# EAGLE design v8_4_controler (EAGLE 9.6.2)
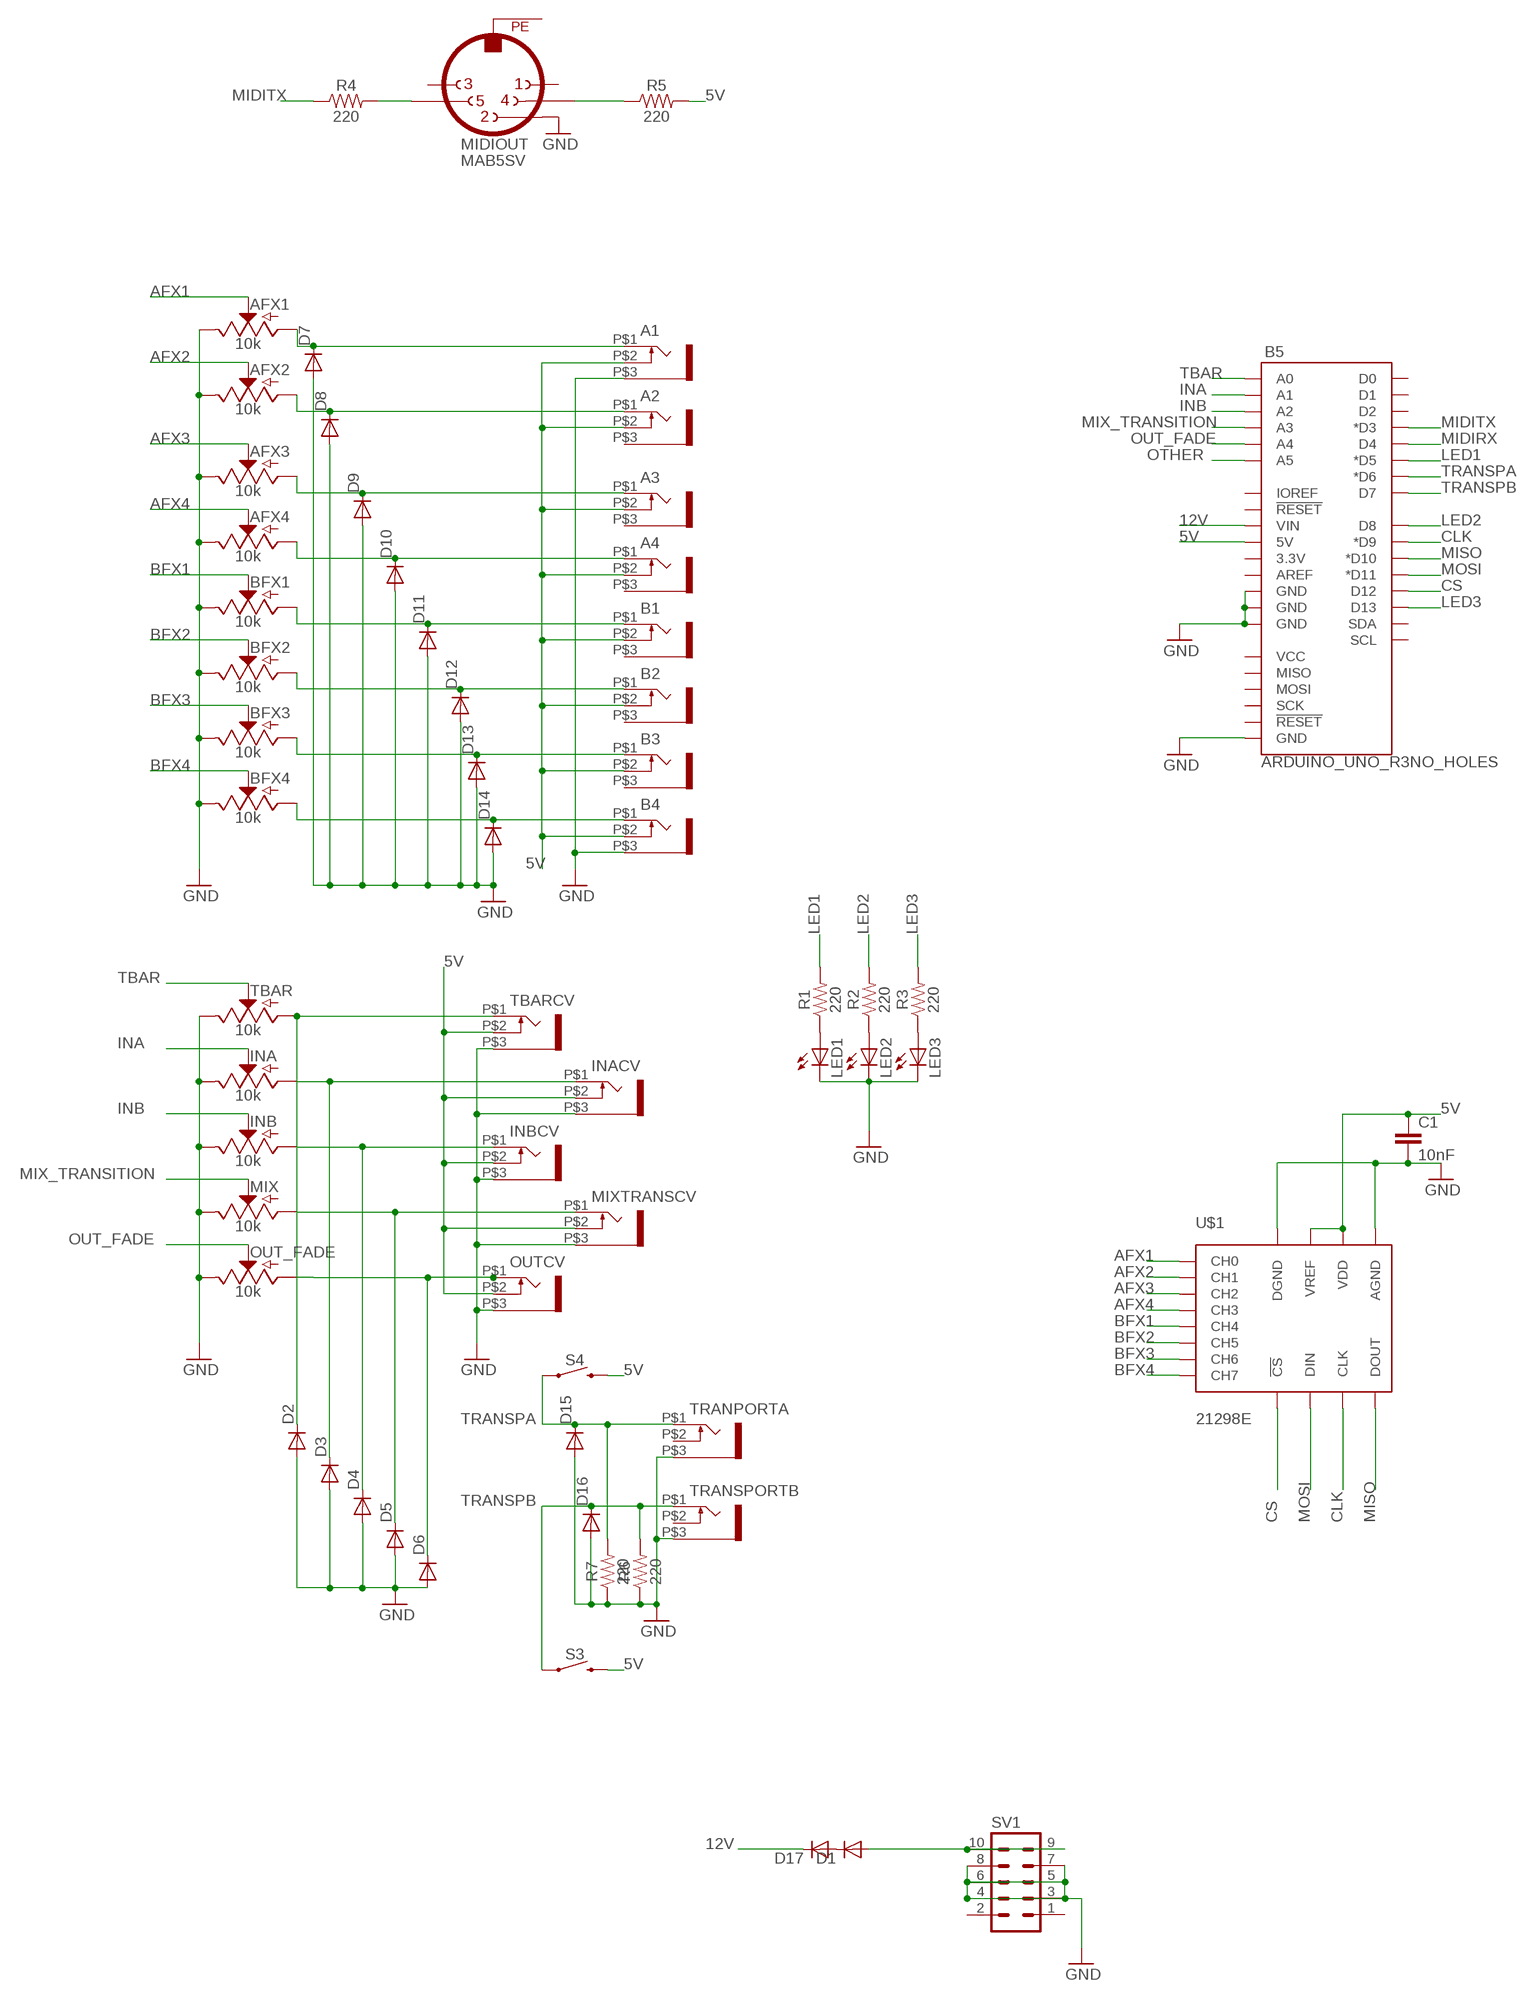
[diagram p0: schematic, sheet 1]

## Parts
A1  WQP-PJ301M-12_JACK  [WQP-PJ301M-12_JACK]
A2  WQP-PJ301M-12_JACK  [WQP-PJ301M-12_JACK]
A3  WQP-PJ301M-12_JACK  [WQP-PJ301M-12_JACK]
A4  WQP-PJ301M-12_JACK  [WQP-PJ301M-12_JACK]
AFX1  10k  POTENTIOMETER-PTH-9MM-1/20W-20%  [POT-PTH-ALPS]
AFX2  10k  POTENTIOMETER-PTH-9MM-1/20W-20%  [POT-PTH-ALPS]
AFX3  10k  POTENTIOMETER-PTH-9MM-1/20W-20%  [POT-PTH-ALPS]
AFX4  10k  POTENTIOMETER-PTH-9MM-1/20W-20%  [POT-PTH-ALPS]
B1  WQP-PJ301M-12_JACK  [WQP-PJ301M-12_JACK]
B2  WQP-PJ301M-12_JACK  [WQP-PJ301M-12_JACK]
B3  WQP-PJ301M-12_JACK  [WQP-PJ301M-12_JACK]
B4  WQP-PJ301M-12_JACK  [WQP-PJ301M-12_JACK]
B5  ARDUINO_UNO_R3NO_HOLES  [ARDUINO_R3_NO_HOLES]
BFX1  10k  POTENTIOMETER-PTH-9MM-1/20W-20%  [POT-PTH-ALPS]
BFX2  10k  POTENTIOMETER-PTH-9MM-1/20W-20%  [POT-PTH-ALPS]
BFX3  10k  POTENTIOMETER-PTH-9MM-1/20W-20%  [POT-PTH-ALPS]
BFX4  10k  POTENTIOMETER-PTH-9MM-1/20W-20%  [POT-PTH-ALPS]
C1  10nF  10NF-PTH-10MM-10000V-1-%  [CAP-PTH-10MM]
D1  1N4004  [DO41-10]
D2  1N4004  [DO41-10]
D3  1N4004  [DO41-10]
D4  1N4004  [DO41-10]
D5  1N4004  [DO41-10]
D6  1N4004  [DO41-10]
D7  1N4004  [DO41-10]
D8  1N4004  [DO41-10]
D9  1N4004  [DO41-10]
D10  1N4004  [DO41-10]
D11  1N4004  [DO41-10]
D12  1N4004  [DO41-10]
D13  1N4004  [DO41-10]
D14  1N4004  [DO41-10]
D15  1N4004  [DO41-10]
D16  1N4004  [DO41-10]
D17  1N4004  [DO41-10]
INA  10k  POTENTIOMETER-PTH-9MM-1/20W-20%  [POT-PTH-ALPS]
INACV  WQP-PJ301M-12_JACK  [WQP-PJ301M-12_JACK]
INB  10k  POTENTIOMETER-PTH-9MM-1/20W-20%  [POT-PTH-ALPS]
INBCV  WQP-PJ301M-12_JACK  [WQP-PJ301M-12_JACK]
LED1  LED3MM  [LED3MM]
LED2  LED3MM  [LED3MM]
LED3  LED3MM  [LED3MM]
MIDIOUT  MAB5SV  [MAB5SV]
MIX  10k  POTENTIOMETER-PTH-9MM-1/20W-20%  [POT-PTH-ALPS]
MIXTRANSCV  WQP-PJ301M-12_JACK  [WQP-PJ301M-12_JACK]
OUT_FADE  10k  POTENTIOMETER-PTH-9MM-1/20W-20%  [POT-PTH-ALPS]
OUTCV  WQP-PJ301M-12_JACK  [WQP-PJ301M-12_JACK]
R1  220  10MOHM-HORIZ-1/4W-5%  [AXIAL-0.3]
R2  220  10MOHM-HORIZ-1/4W-5%  [AXIAL-0.3]
R3  220  10MOHM-HORIZ-1/4W-5%  [AXIAL-0.3]
R4  220  10MOHM-HORIZ-1/4W-5%  [AXIAL-0.3]
R5  220  10MOHM-HORIZ-1/4W-5%  [AXIAL-0.3]
R6  220  10MOHM-HORIZ-1/4W-5%  [AXIAL-0.3]
R7  220  10MOHM-HORIZ-1/4W-5%  [AXIAL-0.3]
S3  MOMENTARY-SWITCH-SPST-PTH-6.0MM  [TACTILE_SWITCH_PTH_6.0MM]
S4  MOMENTARY-SWITCH-SPST-PTH-6.0MM  [TACTILE_SWITCH_PTH_6.0MM]
SV1  MA05-2  [MA05-2]
TBAR  10k  POTENTIOMETER-PTH-9MM-1/20W-20%  [POT-PTH-ALPS]
TBARCV  WQP-PJ301M-12_JACK  [WQP-PJ301M-12_JACK]
TRANPORTA  WQP-PJ301M-12_JACK  [WQP-PJ301M-12_JACK]
TRANSPORTB  WQP-PJ301M-12_JACK  [WQP-PJ301M-12_JACK]
U$1  21298E  [PDIP16]

## Nets
5V: A1.P$2 A2.P$2 A3.P$2 A4.P$2 B1.P$2 B2.P$2 B3.P$2 B4.P$2 B5.5V C1.1 INACV.P$2 INBCV.P$2 MIXTRANSCV.P$2 OUTCV.P$2 R5.P$2 S3.3 S4.3 TBARCV.P$2 U$1.P$15(VREF) U$1.P$16(VDD)
12V: B5.VIN D17.C
AFX1: AFX1.P$2(S) U$1.P$1(CH0)
AFX2: AFX2.P$2(S) U$1.P$2(CH1)
AFX3: AFX3.P$2(S) U$1.P$3(CH2)
AFX4: AFX4.P$2(S) U$1.P$4(CH3)
BFX1: BFX1.P$2(S) U$1.P$5(CH4)
BFX2: BFX2.P$2(S) U$1.P$6(CH5)
BFX3: BFX3.P$2(S) U$1.P$7(CH6)
BFX4: BFX4.P$2(S) U$1.P$8(CH7)
CLK: B5.D9(*D9) U$1.P$13(CLK)
CS: B5.D12 U$1.P$10(!CS)
GND: A1.P$3 AFX1.P$1(E) AFX2.P$1(E) AFX3.P$1(E) AFX4.P$1(E) B4.P$3 B5.GND@1(GND) B5.GND@2(GND) B5.GND@3(GND) B5.GND@4(GND) BFX1.P$1(E) BFX2.P$1(E) BFX3.P$1(E) BFX4.P$1(E) C1.2 D2.A D3.A D4.A D5.A D6.A D7.A D8.A D9.A D10.A D11.A D12.A D13.A D14.A D15.A D16.A INA.P$1(E) INACV.P$3 INB.P$1(E) INBCV.P$3 LED1.K(C) LED2.K(C) LED3.K(C) MIDIOUT.2 MIX.P$1(E) MIXTRANSCV.P$3 OUT_FADE.P$1(E) OUTCV.P$3 R6.P$1 R7.P$1 SV1.3 SV1.4 SV1.5 SV1.6 SV1.7 SV1.8 TBAR.P$1(E) TBARCV.P$3 TRANPORTA.P$3 TRANSPORTB.P$3 U$1.P$9(DGND) U$1.P$14(AGND)
INA: B5.A1 INA.P$2(S)
INB: B5.A2 INB.P$2(S)
LED1: B5.D5(*D5) R1.P$2
LED2: B5.D8 R2.P$2
LED3: B5.D13 R3.P$2
MIDIRX: B5.D4
MIDITX: B5.D3(*D3) R4.P$1
MISO: B5.D10(*D10) U$1.P$12(DOUT)
MIX_TRANSITION: B5.A3 MIX.P$2(S)
MOSI: B5.D11(*D11) U$1.P$11(DIN)
N$1: A1.P$1 AFX1.P$3(A) D7.C
N$2: A2.P$1 AFX2.P$3(A) D8.C
N$3: A3.P$1 AFX3.P$3(A) D9.C
N$4: A4.P$1 AFX4.P$3(A) D10.C
N$5: B1.P$1 BFX1.P$3(A) D11.C
N$6: B2.P$1 BFX2.P$3(A) D12.C
N$7: B3.P$1 BFX3.P$3(A) D13.C
N$8: B4.P$1 BFX4.P$3(A) D14.C
N$9: MIDIOUT.4 R5.P$1
N$10: LED1.A R1.P$1
N$11: MIDIOUT.5 R4.P$2
N$12: LED2.A R2.P$1
N$13: LED3.A R3.P$1
N$14: D2.C TBAR.P$3(A) TBARCV.P$1
N$15: D3.C INA.P$3(A) INACV.P$1
N$16: D4.C INB.P$3(A) INBCV.P$1
N$17: D5.C MIX.P$3(A) MIXTRANSCV.P$1
N$18: D6.C OUT_FADE.P$3(A) OUTCV.P$1
N$20: D1.A SV1.9 SV1.10
N$21: D1.C D17.A
OTHER: B5.A5
OUT_FADE: B5.A4 OUT_FADE.P$2(S)
TBAR: B5.A0 TBAR.P$2(S)
TRANSPA: B5.D6(*D6) D15.C R7.P$2 S4.1 TRANPORTA.P$1
TRANSPB: B5.D7 D16.C R6.P$2 S3.1 TRANSPORTB.P$1
Unconnected: A2.P$3 A3.P$3 A4.P$3 B1.P$3 B2.P$3 B3.P$3 B5.3.3V B5.AREF B5.D0 B5.D1 B5.D2 B5.IOREF B5.MISO B5.MOSI B5.RESET@1(!RESET!) B5.RESET@2(!RESET!) B5.SCK B5.SCL B5.SDA B5.VCC MIDIOUT.1 MIDIOUT.3 SV1.1 SV1.2 TRANPORTA.P$2 TRANSPORTB.P$2

## Power pins joined to a net without a drawn wire
PE: MIDIOUT.PE

## Library data of the parts
A1-A4 B1-B4 INACV INBCV MIXTRANSCV OUTCV TBARCV TRANPORTA TRANSPORTB = thonkiconn:WQP-PJ301M-12_JACK; SPICEPREFIX: U
AFX1-AFX4 BFX1-BFX4 INA INB MIX OUT_FADE TBAR = SparkFun-Resistors:POTENTIOMETER: Potentiometer (Pot) Three-terminal potentiometers, with an adjustable wiper and two adjustable resistors. A pot can be used to create a configurable voltage divider, or as a variable resistor. Variants ALPS_POT and ALPS_POT_KIT - PTH, breadboard compatible, 9mm square pots Rotary Potentiometer - Linear (10k ohm) <https://www.sparkfun.com/products/9288> (COM-09288) The KIT variant exposes copper on only one side of the PTH pad, so the part can only be assembled on one side of the PCB. Useful for beginner soldering kits.; PROD_ID: RES-09177; SF_SKU: COM-09288
B5 = SparkFun-Boards:ARDUINO_UNO_R3: Arduino R3 Footprint with SPI header Arduino Uno R3 Compatible Footprint. Matches PCB size of the original board. SparkFun Products: SAMD21 Dev Breakout <https://www.sparkfun.com/products/13672> RedBoard <https://www.sparkfun.com/products/12757> R3 Stackable Headers <https://www.sparkfun.com/products/11417>
C1 = SparkFun-Capacitors:10NF: 0.01uF/10nF/10,000pF ceramic capacitors A capacitor is a passive two-terminal electrical component used to store electrical energy temporarily in an electric field. CAP-09321; PROD_ID: CAP-09321
D1-D17 = diode:1N4004: DIODE general purpose rectifier, 1 A
LED1-LED3 = adafruit:LED: LED OSRAM: - CHIPLED LG R971, LG N971, LY N971, LG Q971, LY Q971, LO R971, LY R971 LH N974, LH R974 LS Q976, LO Q976, LY Q976 LO Q996 - Hyper CHIPLED LW Q18S LB Q993, LB Q99A, LB R99A - SideLED LS A670, LO A670, LY A670, LG A670, LP A670 LB A673, LV A673, LT A673, LW A673 LH A674 LY A675 LS A676, LA A676, LO A676, LY A676, LW A676 LS A679, LY A679, LG A679 - Hyper Micro SIDELED® LS Y876, LA Y876, LO Y876, LY Y876 LT Y87S - SmartLED LW L88C, LW L88S LB L89C, LB L89S, LG L890 LS L89K, LO L89K, LY L89K LS L896, LA L896, LO L896, LY L896 - TOPLED LS T670, LO T670, LY T670, LG T670, LP T670 LSG T670, LSP T670, LSY T670, LOP T670, LYG T670 LG T671, LOG T671, LSG T671 LB T673, LV T673, LT T673, LW T673 LH T674 LS T676, LA T676, LO T676, LY T676, LB T676, LH T676, LSB T676, LW T676 LB T67C, LV T67C, LT T67C, LS T67K, LO T67K, LY T67K, LW E67C LS E67B, LA E67B, LO E67B, LY E67B, LB E67C, LV E67C, LT E67C LW T67C LS T679, LY T679, LG T679 LS T770, LO T770, LY T770, LG T770, LP T770 LB T773, LV T773, LT T773, LW T773 LH T774 LS E675, LA E675, LY E675, LS T675 LS T776, LA T776, LO T776, LY T776, LB T776 LHGB T686 LT T68C, LB T68C - Hyper Mini TOPLED® LB M676 - Mini TOPLED Santana® LG M470 LS M47K, LO M47K, LY M47K Source: http://www.osram.convergy.de/
MIDIOUT = con-hirschmann:MAB5SV: Female CONNECTOR 5 pins 90 deg. with shield, vertical (DIN41524); OC_FARNELL: unknown; OC_NEWARK: unknown
R1-R7 = SparkFun-Resistors:10MOHM: RES-09327; PROD_ID: RES-09327; VALUE: 10M
S3 S4 = SparkFun-Switches:MOMENTARY-SWITCH-SPST: Momentary Switch (Pushbutton) - SPST Normally-open (NO) SPST momentary switches (buttons, pushbuttons). Variants PTH-12MM - 12mm square, through-hole Momentary Pushbutton Switch - 12mm Square <https://www.sparkfun.com/products/9190> (COM-09190) PTH-6.0MM, PTH-6.0MM-KIT - 6.0mm square, through-hole Mini Pushbutton Switch <https://www.sparkfun.com/products/97> (COM-00097) KIT package intended for soldering kit's - only one side of pads' copper is exposed. PTH-RIGHT-ANGLE-KIT - Right-angle, through-hole Right Angle Tactile Button <https://www.sparkfun.com/products/10791> - Used on SparkFun BigTime Watch Kit <https://www.sparkfun.com/products/11734> SMD-12MM - 12mm square, surface-mount Tactile Button - SMD (12mm) <https://www.sparkfun.com/products/12993> (COM-12993) Used on SparkFun PicoBoard <https://www.sparkfun.com/products/11888> SMD-4.5MM - 4.5mm Square Trackball Switch Used on SparkFun Blackberry Trackballer Breakout <https://www.sparkfun.com/products/13169> SMD-4.6MMX2.8MM - 4.60mm x 2.80mm, surface mount Used on SparkFun SAMD21 Mini Breakout <https://www.sparkfun.com/products/13664> SMD-5.2MM, SMD-5.2-REDUNDANT - 5.2mm square, surface-mount Mini Pushbutton Switch - SMD <https://www.sparkfun.com/products/8720> (COM-08720) Used on Arduino Pro Mini <https://www.sparkfun.com/products/11114> REDUNDANT package connects both switch circuits together SMD-6.0X3.5MM - 6.0 x 3.5mm, surface mount Momentary Reset Switch SMD <https://www.sparkfun.com/products/8229> (COM-08229) SMD-6.2MM-TALL - 6.2mm square, surface mount Tactile Button - SMD (6mm) <https://www.sparkfun.com/products/12992> Used on SparkFun Digital Sandbox <https://www.sparkfun.com/products/12651> SMD-RIGHT-ANGLE - Right-angle, surface mount Used on SparkFun Block for Intel® Edison - Arduino <https://www.sparkfun.com/products/13036>; PROD_ID: SWCH-08441; SF_SKU: COM-00097
SV1 = con-lstb:MA05-2: PIN HEADER; OC_FARNELL: unknown; OC_NEWARK: unknown
U$1 = MCP3208:21298E

## Board
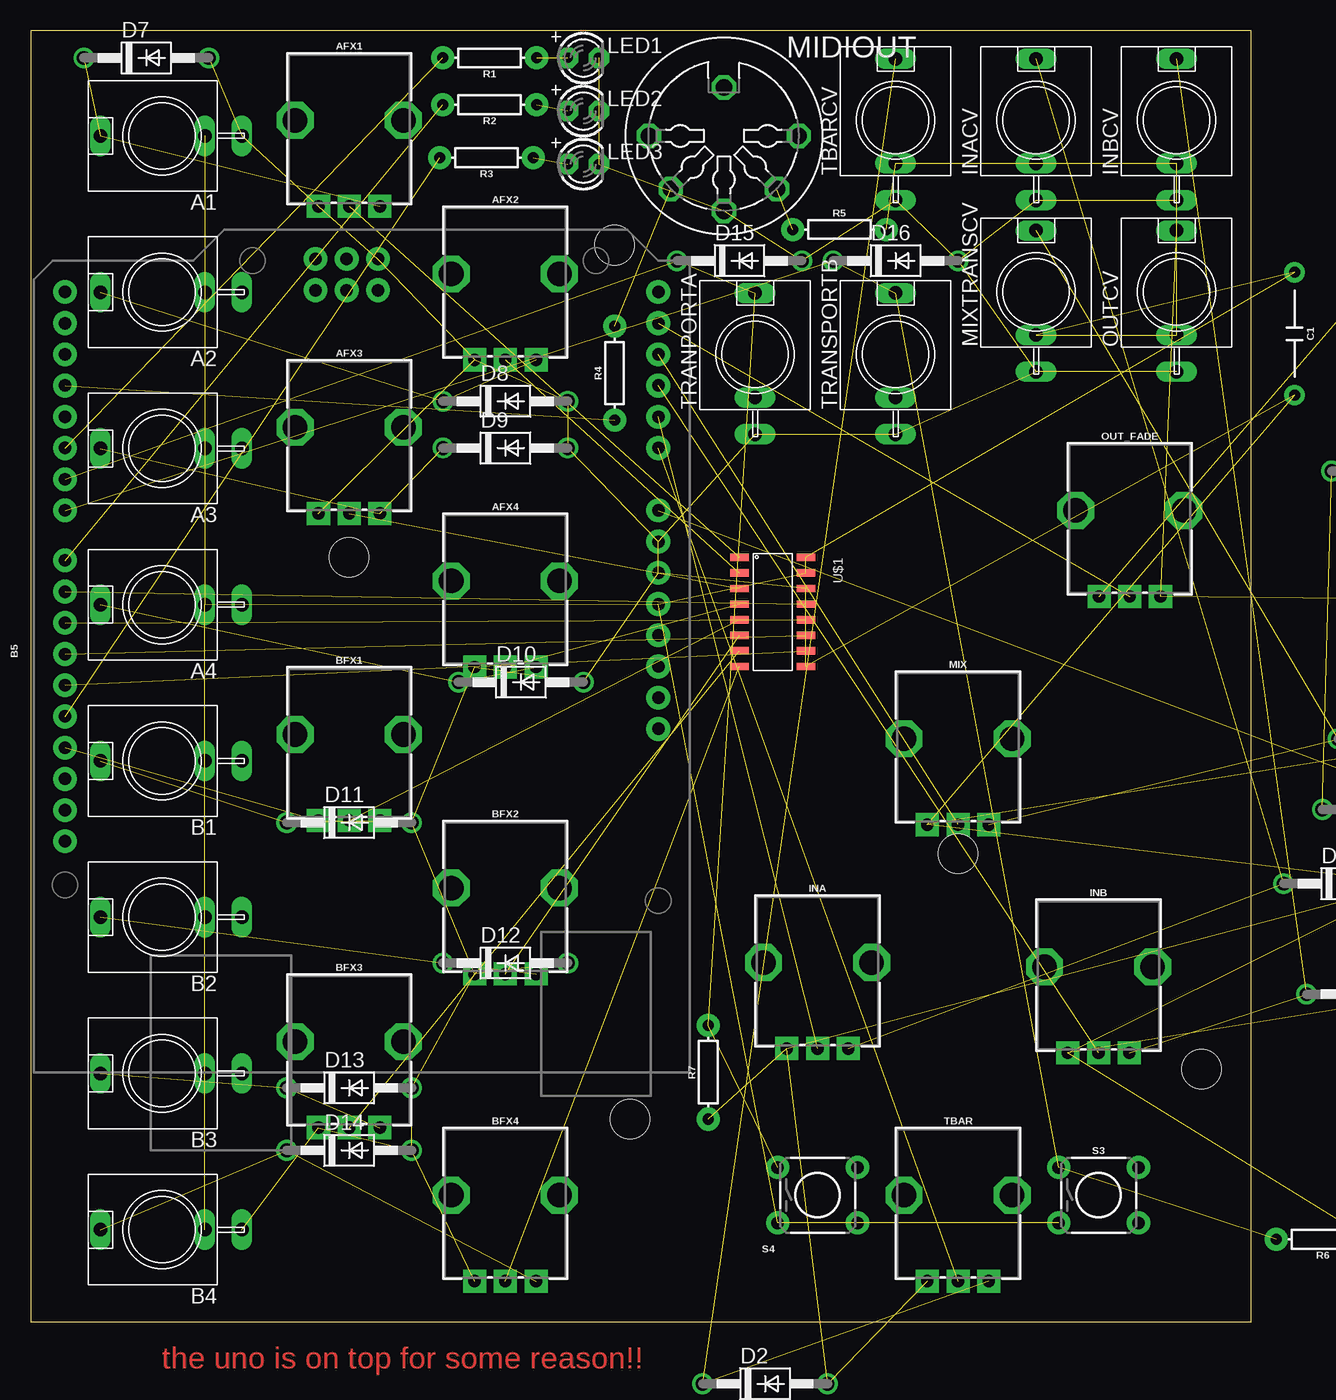
[diagram p1: board, top side]
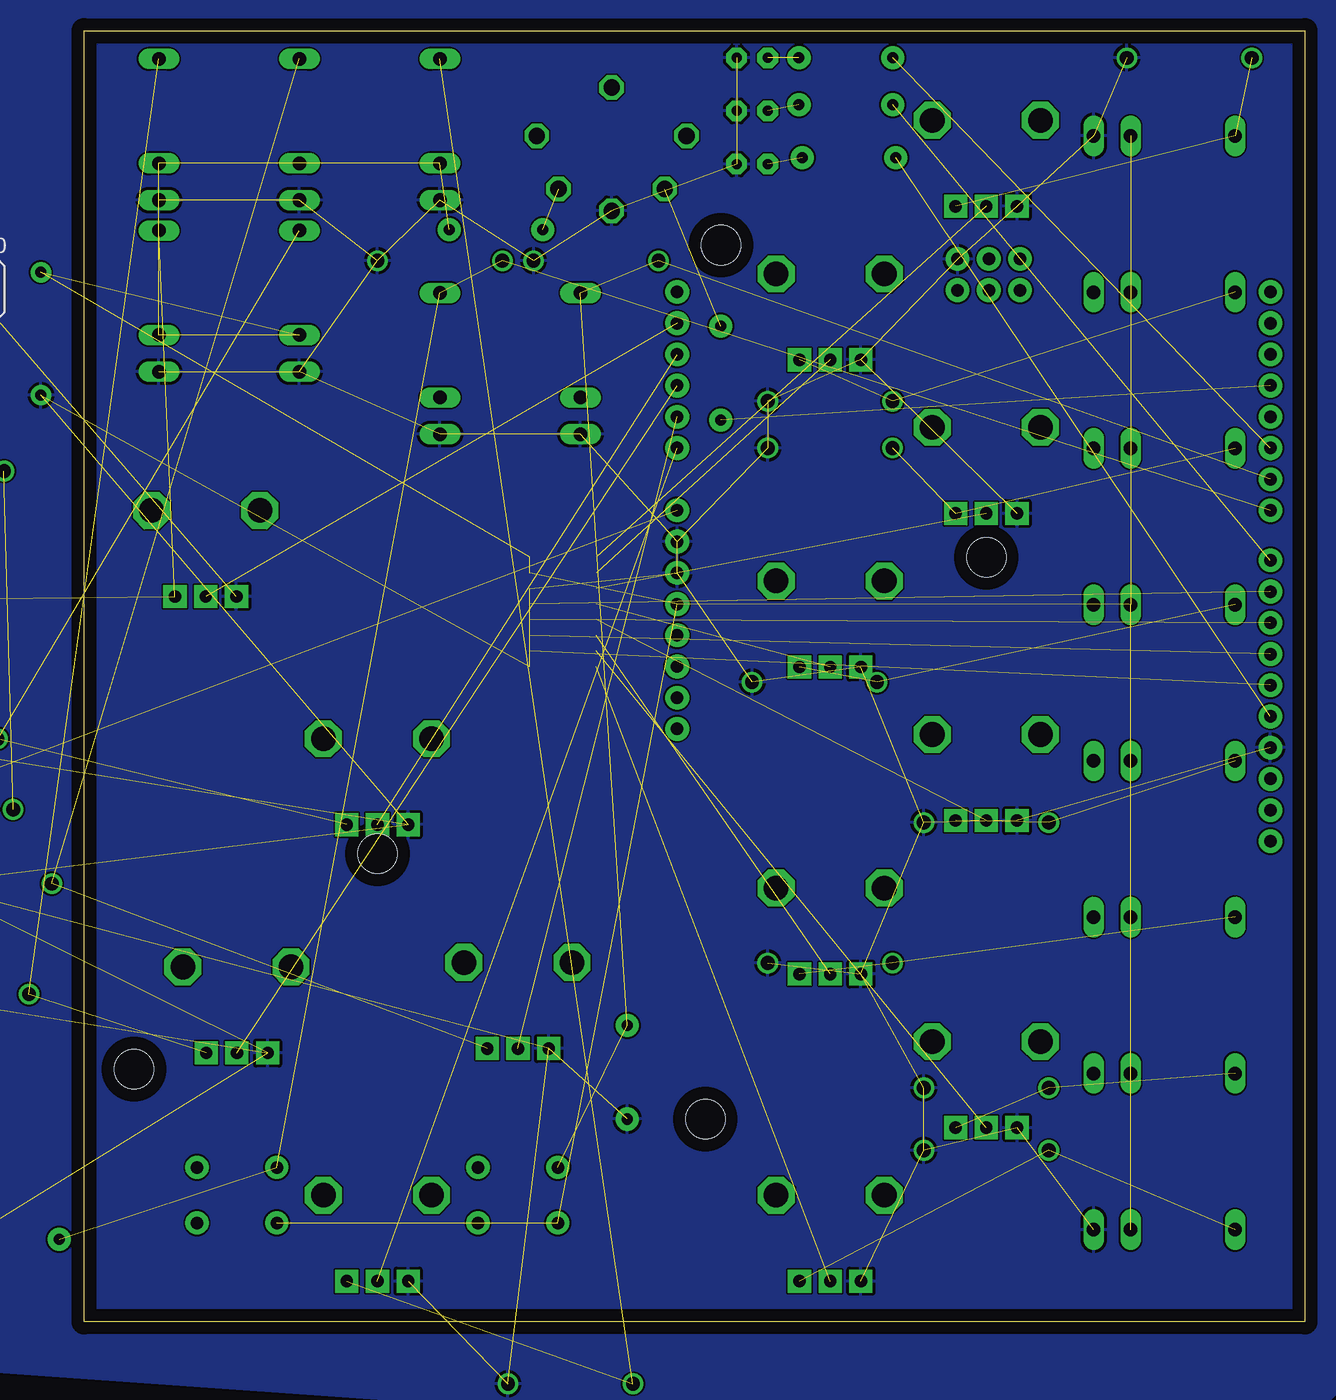
[diagram p2: board, bottom side, seen from below]

Size 99.29 x 105.08 mm. Coordinates in mm from the lower left corner, seen from the top.
Outline: 0,0 99.29,0 99.29,105.08 0,105.08 0,0
Copper layers (1*16): Top 0.035mm / dielectric 1.5mm / Bottom 0.035mm
Design rules "default": minimum track width 6mil, minimum drill 0.35mm, track to track 6mil, track to pad 6mil, pad to pad 6mil, via to via 6mil, smd to smd 6mil, copper to edge 40mil, drill to drill 6mil, minimum pad ring 10mil, minimum via ring 8mil, stop-mask expansion 4mil, vias tented up to drill 0mil, thermal gap 10mil
Holes 3.2 mm at 48.77,16.51 47.5,87.63 25.91,62.23 75.44,38.1 95.25,20.57

### Footprints (pad centres in the part's own frame; a part is rotated, then mirrored left to right if it is on the bottom)
WQP-PJ301M-12_JACK = drill 1.1 long: P$1 0,5; P$2 0,-3.5; P$3 0,-6.5
POT-PTH-ALPS = drill 1 pad 1.88 square: P$1 7,-2.5; P$2 7,0; P$3 7,2.5 | drill 2 octagon: P$4 0,-4.4; P$5 0,4.4
ARDUINO_R3_NO_HOLES = drill 1.016 pad 1.93: 3.3V 1.27,-24.13; 5V 3.81,-24.13; A0 16.51,-24.13; A1 19.05,-24.13; A2 21.59,-24.13; A3 24.13,-24.13; A4 26.67,-24.13; A5 29.21,-24.13; AREF -10.414,24.13; D0 29.21,24.13; D1 26.67,24.13; D2 24.13,24.13; D3 21.59,24.13; D4 19.05,24.13; D5 16.51,24.13; D6 13.97,24.13; D7 11.43,24.13; D8 7.366,24.13; D9 4.826,24.13; D10 2.286,24.13; D11 -0.254,24.13; D12 -2.794,24.13; D13 -5.334,24.13; GND@1 6.35,-24.13; GND@2 8.89,-24.13; GND@3 -7.874,24.13; GND@4 31.89,-1.32; IOREF -3.81,-24.13; MISO 29.35,3.76; MOSI 31.89,1.22; NC -6.35,-24.13; RESET@1 -1.27,-24.13; RESET@2 29.35,-1.32; SCK 29.35,1.22; SCL -15.494,24.13; SDA -12.954,24.13; VCC 31.89,3.76; VIN 11.43,-24.13
CAP-PTH-10MM = drill 0.9 pad 1.651: 1 -5,0; 2 5,0
DO41-10 = drill 1.118: A 5.08,0; C -5.08,0
LED3MM = drill 0.813 pad 1.676 octagon: A -1.27,0; K 1.27,0
MAB5SV = drill 1.321 octagon: 1 6.096,0; 2 0,-6.096; 3 -6.096,0; 4 4.318,-4.318; 5 -4.318,-4.318; PE 0,3.937
AXIAL-0.3 = drill 0.9 pad 1.88: P$1 -3.81,0; P$2 3.81,0
TACTILE_SWITCH_PTH_6.0MM = drill 1.016 pad 1.88: 1 -3.251,2.261; 2 3.251,2.261; 3 -3.251,-2.261; 4 3.251,-2.261
MA05-2 = drill 1.016 octagon: 1 -5.08,-1.27; 2 -5.08,1.27; 3 -2.54,-1.27; 4 -2.54,1.27; 5 0,-1.27; 6 0,1.27; 7 2.54,-1.27; 8 2.54,1.27; 9 5.08,-1.27; 10 5.08,1.27
PDIP16 = smd 0.6 x 1.5: P$1 0,0; P$2 1.27,0; P$3 2.54,0; P$4 3.81,0; P$5 5.08,0; P$6 6.35,0; P$7 7.62,0; P$8 8.89,0; P$9 8.89,5.4; P$10 7.62,5.4; P$11 6.35,5.4; P$12 5.08,5.4; P$13 3.81,5.4; P$14 2.54,5.4; P$15 1.27,5.4; P$16 0,5.4

### Placement (x,y rotation side)
A1  10.67,96.52 90 top
A2  10.67,83.8 90 top
A3  10.67,71.09 90 top
A4  10.67,58.37 90 top
AFX1  25.91,97.79 270 top
AFX2  38.61,85.29 270 top
AFX3  25.91,72.8 270 top
AFX4  38.61,60.3 270 top
B1  10.67,45.66 90 top
B2  10.67,32.94 90 top
B3  10.67,20.23 90 top
B4  10.67,7.51 90 top
B5  26.92,54.61 90 top
BFX1  25.91,47.81 270 top
BFX2  38.61,35.31 270 top
BFX3  25.91,22.82 270 top
BFX4  38.61,10.32 270 top
C1  102.82,80.42 270 top  (outside the outline)
D1  110.9,69.24 0 top  (outside the outline)
D2  59.74,-5.03 0 top  (outside the outline)
D3  107.01,35.67 0 top
D4  108.87,26.67 0 top  (outside the outline)
D5  111.44,47.45 0 top  (outside the outline)
D6  112.41,58.88 0 top  (outside the outline)
D7  9.4,102.87 0 top
D8  38.61,74.93 0 top
D9  38.61,71.12 0 top
D10  39.88,52.07 0 top
D11  25.91,40.64 0 top
D12  38.61,29.21 0 top
D13  25.91,19.05 0 top
D14  25.91,13.97 0 top
D15  57.66,86.36 0 top
D16  70.36,86.36 0 top
D17  110.15,41.7 180 top  (outside the outline)
INA  64.01,29.25 270 top
INACV  81.79,97.79 0 top
INB  86.87,28.89 270 top
INBCV  93.22,97.79 0 top
LED1  44.96,102.87 0 top
LED2  44.96,98.55 0 top
LED3  44.96,94.23 0 top
MIDIOUT  56.39,96.52 0 top
MIX  75.44,47.47 270 top
MIXTRANSCV  81.79,83.82 0 top
OUT_FADE  89.41,66.04 270 top
OUTCV  93.22,83.82 0 top
R1  37.34,102.87 180 top
R2  37.34,99.06 180 top
R3  37.08,94.74 180 top
R4  47.5,77.22 90 top
R5  65.79,88.9 0 top
R6  105.12,6.73 180 top
R7  55.12,20.32 90 top
S3  86.87,10.32 0 top
S4  64.01,10.32 0 top
SV1  112.15,84.05 0 bottom  (outside the outline)
TBAR  75.44,10.32 270 top
TBARCV  70.36,97.79 0 top
TRANPORTA  58.93,78.74 0 top
TRANSPORTB  70.36,78.74 0 top
U$1  57.66,62.23 270 top

### Tracks (layer width: path | path; a pad name or v marks a point on that pad's centre or on a via)
5V  (19 unrouted)
12V  (1 unrouted)
AFX1  (1 unrouted)
AFX2  (1 unrouted)
AFX3  (1 unrouted)
AFX4  (1 unrouted)
BFX1  (1 unrouted)
BFX2  (1 unrouted)
BFX3  (1 unrouted)
BFX4  (1 unrouted)
CLK  (1 unrouted)
CS  (1 unrouted)
GND  (55 unrouted)
  pour Bottom: -8.38,111.76 103.38,111.76 112.27,102.87 112.27,-3.65 2.98,-11.36 -12.19,3.81 -12.19,88.9
INA  (1 unrouted)
INB  (1 unrouted)
LED1  (1 unrouted)
LED2  (1 unrouted)
LED3  (1 unrouted)
MIDITX  (1 unrouted)
MISO  (1 unrouted)
MIX_TRANSITION  (1 unrouted)
MOSI  (1 unrouted)
N$1  (2 unrouted)
N$2  (2 unrouted)
N$3  (2 unrouted)
N$4  (2 unrouted)
N$5  (2 unrouted)
N$6  (2 unrouted)
N$7  (2 unrouted)
N$8  (2 unrouted)
N$9  (1 unrouted)
N$10  (1 unrouted)
N$11  (1 unrouted)
N$12  (1 unrouted)
N$13  (1 unrouted)
N$14  (2 unrouted)
N$15  (2 unrouted)
N$16  (2 unrouted)
N$17  (2 unrouted)
N$18  (2 unrouted)
N$20  (2 unrouted)
N$21  (1 unrouted)
OUT_FADE  (1 unrouted)
TBAR  (1 unrouted)
TRANSPA  (4 unrouted)
TRANSPB  (4 unrouted)

### Text on the board
Top: the uno is on top for some reason!!